# Altium schematic sheet FOTA MicroController Status LEDs.SchDoc: FOTA Microcontroller Status LED's
size A4; SheetNumber: 22; SheetTotal: 37
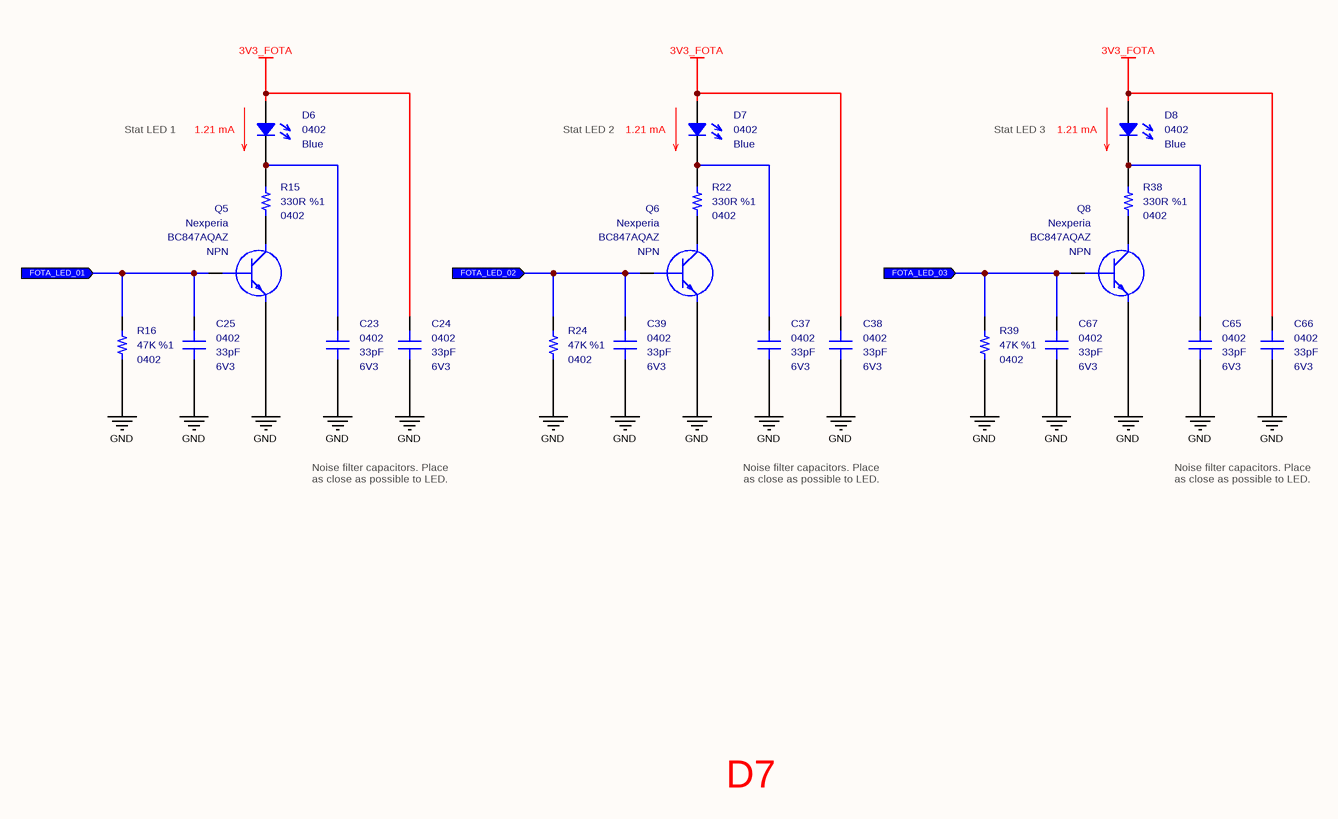
[diagram p0: FOTA MicroController Status LEDs.SchDoc]

## Parts
C23  value 33pF  Case: 0402  Voltage: 6V3  [CAPACITOR_0402]  (hidden comment: Multilayer Ceramic Capacitor)
C24  value 33pF  Case: 0402  Voltage: 6V3  [CAPACITOR_0402]  (hidden comment: Multilayer Ceramic Capacitor)
C25  value 33pF  Case: 0402  Voltage: 6V3  [CAPACITOR_0402]  (hidden comment: Multilayer Ceramic Capacitor)
C37  value 33pF  Case: 0402  Voltage: 6V3  [CAPACITOR_0402]  (hidden comment: Multilayer Ceramic Capacitor)
C38  value 33pF  Case: 0402  Voltage: 6V3  [CAPACITOR_0402]  (hidden comment: Multilayer Ceramic Capacitor)
C39  value 33pF  Case: 0402  Voltage: 6V3  [CAPACITOR_0402]  (hidden comment: Multilayer Ceramic Capacitor)
C65  value 33pF  Case: 0402  Voltage: 6V3  [CAPACITOR_0402]  (hidden comment: Multilayer Ceramic Capacitor)
C66  value 33pF  Case: 0402  Voltage: 6V3  [CAPACITOR_0402]  (hidden comment: Multilayer Ceramic Capacitor)
C67  value 33pF  Case: 0402  Voltage: 6V3  [CAPACITOR_0402]  (hidden comment: Multilayer Ceramic Capacitor)
D6  Case: 0402  Color: Blue  [LED_0402]  (hidden comment: SMD LED (Blue))
D7  Case: 0402  Color: Blue  [LED_0402]  (hidden comment: SMD LED (Blue))
D8  Case: 0402  Color: Blue  [LED_0402]  (hidden comment: SMD LED (Blue))
Q5  Manufacturer_Name: Nexperia  Manufacturer_Part_Number: BC847AQAZ  Polarity: NPN  [SOT1215]  (hidden comment: Bipolar NPN Transistors)
Q6  Manufacturer_Name: Nexperia  Manufacturer_Part_Number: BC847AQAZ  Polarity: NPN  [SOT1215]  (hidden comment: Bipolar NPN Transistors)
Q8  Manufacturer_Name: Nexperia  Manufacturer_Part_Number: BC847AQAZ  Polarity: NPN  [SOT1215]  (hidden comment: Bipolar NPN Transistors)
R15  value 330R  Tolerance: %1  Case: 0402  [RESISTOR_0402]  (hidden comment: Thick Film Resistor)
R16  value 47K  Tolerance: %1  Case: 0402  [RESISTOR_0402]  (hidden comment: Thick Film Resistor)
R22  value 330R  Tolerance: %1  Case: 0402  [RESISTOR_0402]  (hidden comment: Thick Film Resistor)
R24  value 47K  Tolerance: %1  Case: 0402  [RESISTOR_0402]  (hidden comment: Thick Film Resistor)
R38  value 330R  Tolerance: %1  Case: 0402  [RESISTOR_0402]  (hidden comment: Thick Film Resistor)
R39  value 47K  Tolerance: %1  Case: 0402  [RESISTOR_0402]  (hidden comment: Thick Film Resistor)

## Ports
FOTA_LED_01 (in), FOTA_LED_02 (in), FOTA_LED_03 (in)

## Nets
3V3_FOTA: C24.1 C38.1 C66.1 D6.2 D7.2 D8.2
GND: C23.2 C24.2 C25.2 C37.2 C38.2 C39.2 C65.2 C66.2 C67.2 Q5.2(E) Q6.2(E) Q8.2(E) R16.1 R24.1 R39.1
FOTA_LED_01: C25.1 Q5.1(B) R16.2 ; port FOTA_LED_01
FOTA_LED_02: C39.1 Q6.1(B) R24.2 ; port FOTA_LED_02
FOTA_LED_03: C67.1 Q8.1(B) R39.2 ; port FOTA_LED_03
NetC23_1: C23.1 D6.1 R15.2
NetC37_1: C37.1 D7.1 R22.2
NetC65_1: C65.1 D8.1 R38.2
NetQ5_3: Q5.3(C) R15.1
NetQ6_3: Q6.3(C) R22.1
NetQ8_3: Q8.3(C) R38.1

## Notes on the sheet
- Stat LED 1
- (near D6) 1.21 mA
- Stat LED 2
- (near D7) 1.21 mA
- Stat LED 3
- (near D8) 1.21 mA
- Noise filter capacitors. Place as close as possible to LED.
- D7
- Title
- Size:
- Date:
- A4
- Number:
- Time:
- Revision:
- Sheet
- of
- File:

## Library data of the parts
C23-C25 C37-C39 C65-C67 = Capacitor - 33pF [0402-6V3]: Capacitor - 33pF [0402] (Ceramic); Manufacturer_Name: Kemet; Manufacturer_Part_Number: C0402C330J9RACAUTO; Dielectric: X7R; Tolerance: 10%; Height: 0.5mm; Mouser_Part_Number: 80-C0402C330J9RAUTO; Maximum Operating Temperature: +125; Minimum Operating Temperature: -55; ROHS: Yes; ComponentLink1Description: DataSheet; ComponentLink1URL: https://api.kemet.com/component-edge/download/datasheet/C0402C330J9RACAUTO.pdf; ComponentLink2Description: Mouser; ComponentLink2URL: https://www.mouser.com/Search/Refine.aspx?Keyword=80-C0402C330J9RAUTO; Supplier 1: Mouser; Supplier Part Number 1: 80-C0402C330J9RAUTO
D6-D8 = Diode - LED (0402-Blue): Standard LEDs - SMD PICOLEDTM;BLUE LED; 25M @ 5MA; Manufacturer_Name: ROHM Semiconductor; Manufacturer_Part_Number: SMLP13BC8TT86; Mouser_Part_Number: 755-SMLP13BC8TT86; ROHS: Yes; ComponentLink1Description: DataSheet; ComponentLink1URL: https://d1d2qsbl8m0m72.cloudfront.net/en/products/databook/datasheet/opto/led/chip_mono/sml-p1-e.pdf; ComponentLink2Description: Mouser; ComponentLink2URL: https://www.mouser.com.tr/ProductDetail/ROHM-Semiconductor/SMLP13BC8TT86?qs=%2Fha2pyFaduidYDgXFKL%252BNZwCVZNUI4FlyPWWbVDx1b6ABmzS%252BS2f0w%3D%3D; Supplier 1: Mouser; Supplier 2: Digi-Key; Supplier Part Number 1: 755-SMLP13BC8TT86; Supplier Part Number 2: 846-1112-1-ND
Q5 Q6 Q8 = Transistor - BC847: Bipolar Transistors - BJT BC847AQA/DFN1010D-3/REEL 7" Q2; Mouser_Part_Number: 771-BC847AQAZ; ComponentLink1Description: DataSheet; ComponentLink1URL: https://www.mouser.com.tr/datasheet/2/916/BC847XQA_SER-1598405.pdf; ComponentLink2Description: Mouser; ComponentLink2URL: https://www.mouser.com.tr/ProductDetail/Nexperia/BC847AQAZ?qs=%2Fha2pyFaduhKMCPKNtQimeJpXTw9z4AqURd2YARs8DVICZNv3AT9Dw%3D%3D; Case: DFN-1010D-3; Supplier 1: Mouser; Supplier 2: Digi-Key; Supplier Part Number 1: 771-BC847AQAZ; Supplier Part Number 2: 1727-2545-1-ND
R15 R22 R38 = Resistor - 330R: Thick Film Resistors - SMD 1/16 W 330 Ohm 1%; Manufacturer_Name: Vishay; Manufacturer_Part_Number: CRCW0402330RFKED; Height: 0.4mm; Mouser_Part_Number: 71-CRCW0402-330-E3; ComponentLink1Description: DataSheet; ComponentLink1URL: https://www.mouser.com.tr/datasheet/2/427/dcrcwe3-1762152.pdf; ComponentLink2Description: Mouser; ComponentLink2URL: https://www.mouser.com.tr/ProductDetail/Vishay-Dale/CRCW0402330RFKED?qs=sGAEpiMZZMu61qfTUdNhG2DpbjADlD3GGS6SwBlLi5Q%3D; Supplier 1: Mouser; Supplier 2: Digi-Key; Supplier Part Number 2: 541-330LCT-ND; Supplier Part Number 1: 71-CRCW0402-330-E3
R16 R24 R39 = Resistor - 47K: Thick Film Resistors - SMD 1/16 W 47 Kohms 1%; Manufacturer_Name: Vishay; Manufacturer_Part_Number: CRCW040247K0FKED; Height: 0.4mm; Mouser_Part_Number: 71-CRCW0402-47K-E3; ComponentLink1Description: DataSheet; ComponentLink1URL: https://www.mouser.com.tr/datasheet/2/427/dcrcwe3-1762152.pdf; ComponentLink2Description: Mouser; ComponentLink2URL: https://www.mouser.com.tr/ProductDetail/Vishay-Dale/CRCW040247K0FKED?qs=sGAEpiMZZMu61qfTUdNhG2DpbjADlD3GL%252B3h1elTxqU%3D; Supplier 1: Mouser; Supplier 2: Digi-Key; Supplier Part Number 1: 71-CRCW040247K0FKEDH; Supplier Part Number 2: 541-47.0KYCT-ND